# EAGLE schematic raspberrypi (EAGLE 9.6.1)
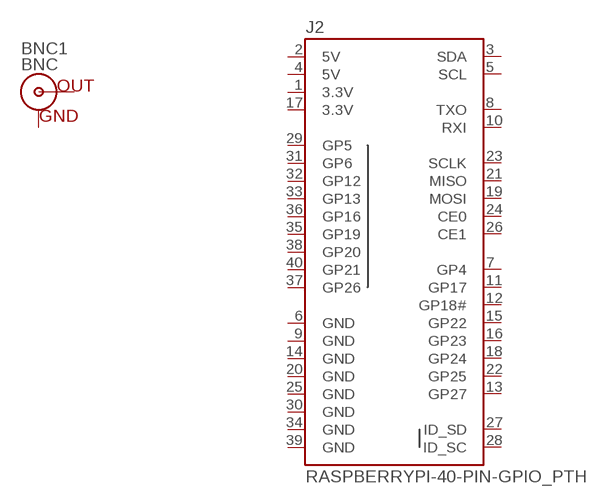
[diagram p0: schematic, sheet 1]

## Parts
BNC1  BNC  BNCPTH  [BNC]
J2  RASPBERRYPI-40-PIN-GPIO_PTH  [2X20_SHROUDED]
Unconnected: BNC1.GND BNC1.S(OUT) J2.3(SDA) J2.5(SCL) J2.7(GP4) J2.8(TXO) J2.10(RXI) J2.11(GP17) J2.12(GP18#) J2.13(GP27) J2.15(GP22) J2.16(GP23) J2.18(GP24) J2.19(MOSI) J2.21(MISO) J2.22(GP25) J2.23(SCLK) J2.24(CE0) J2.26(CE1) J2.27(ID_SD) J2.28(ID_SC) J2.29(GP5) J2.31(GP6) J2.32(GP12) J2.33(GP13) J2.35(GP19) J2.36(GP16) J2.37(GP26) J2.38(GP20) J2.40(GP21)

## Power pins joined to a net without a drawn wire
3.3V: J2.1(3.3V) J2.17(3.3V)
5V: J2.2(5V) J2.4(5V)
GND: J2.6(GND) J2.9(GND) J2.14(GND) J2.20(GND) J2.25(GND) J2.30(GND) J2.34(GND) J2.39(GND)

## Library data of the parts
BNC1 = SparkFun-Connectors:BNC: BNC Right Angle Connector Mouser Part# 5227161 SparkFun Products: BNC Connector - Right Angle <https://www.sparkfun.com/products/10550>; PROD_ID: LPA-12729; SF_ID: PRT-10550
J2 = SparkFun-Connectors:RASPBERRYPI-40-PIN-GPIO: Raspberry Pi GPIO Header 2x20 pin connector, as found on B, B+, A+ models. Both shrouded PTH and SMT versions available. SparkFun Products: GPIO Shrouded Header <https://www.sparkfun.com/products/13054>- PTH SparkFun Pi Wedge (Preassembled) <https://www.sparkfun.com/products/13717>; PROD_ID: CONN-12263; SF_ID: PRT-13054

## Net classes
2 lowpower: width 0.305 mm, drill 0.483 mm